# Altium schematic sheet charger.SchDoc
size A4; SheetNumber: 1; SheetTotal: 1
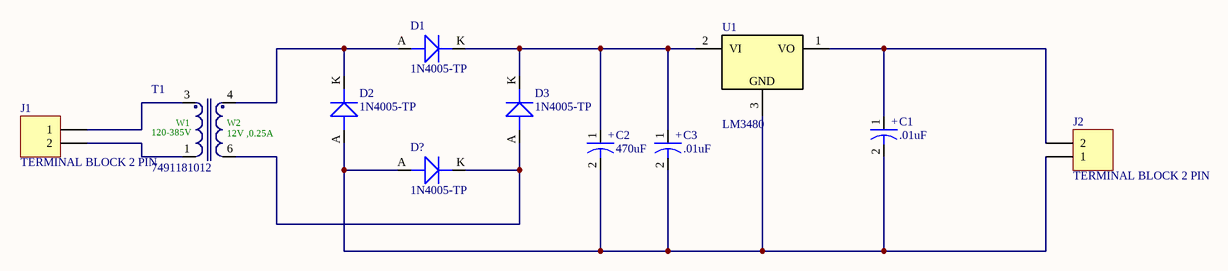
[diagram p0: charger.SchDoc]

## Parts
C1  .01uF  [ACAP_P305_D393_H393_RAD]
C2  470uF  [ACAP_P305_D393_H393_RAD]
C3  .01uF  [ACAP_P305_D393_H393_RAD]
D1  1N4005-TP  [DIO_DO-201AD_TH]
D2  1N4005-TP  [DIO_DO-201AD_TH]
D3  1N4005-TP  [DIO_DO-201AD_TH]
D?  1N4005-TP  [DIO_DO-201AD_TH]
J1  TERMINAL BLOCK 2 PIN  [CON2_P196_1729128_TH_ST]
J2  TERMINAL BLOCK 2 PIN  [CON2_P196_1729128_TH_ST]
T1  7491181012  [EE13_7_4-Vertical_(EF12.6)]
U1  LM3480  [SOT 23-3]

## Nets
NetC1_1: C1.1 J2.2 U1.1(VO)
NetC1_2: C1.2 C2.2 C3.2 D2.A(ANODE) D?.A(ANODE) J2.1 U1.3
NetC2_1: C2.1 C3.1 D1.K(CATHODE) D3.K(CATHODE) U1.2(VI)
NetD1_A: D1.A(ANODE) D2.K(CATHODE) T1.4
NetD3_A: D3.A(ANODE) D?.K(CATHODE) T1.6
NetJ1_1: J1.1 T1.3
NetJ1_2: J1.2 T1.1

## Notes on the sheet
- (in symbol CAP-P_100uF-50V-20%-RAD) +
- (in symbol CMP-1476-00004-1) W1; W2; 120-385V; 12V ,0.25A
- (in symbol REG_30V-5V-100mA-1.4W-SOT23-3) GND

## Library data of the parts
C1-C3 = CAP-P_100uF-50V-20%-RAD: 100µF 50V Aluminum Polymer Capacitor Radial, Can - SMD 28mOhm 4000 Hrs @ 125°C; Manufacturer: Nichicon; Manufacturer Part Number: GYA1H101MCQ1GS; Alternate Part Number-1: VEU101M1HTR-1010; Case/Package: Radial-SMD; Supplier-1: SP ROAD; Supplier Part Number-1: GYA1H101MCQ1GS
D1-D3 D? = DIO_600V-1A-DO-41: Diode Standard 600V 1A Through Hole DO-41; Manufacturer: Vishay Semiconductors; Alternate Part Number-1: NA; Manufacturer Part Number: 1N4005-TP; Case/Package: DO-41; Supplier-1: SIRICOM; Supplier Part Number-1: 1N4007
J1 J2 = CON-TB_2X1-196-ST-TH: 2 Pins, 1 Row 5mm Pitch, straight Connector, male; Manufacturer: Phoenix Contact; Manufacturer Part Number: MKDSN1,5/2; Alternate Part Number-1: NA; Case/Package: TH-CON; Supplier-1: SP ROAD; Supplier Part Number-1: MKDSN1,5/2
T1 = CMP-1476-00004-1: Off-Line Transformer WE-UNIT , L=2.8mH; Manufacturer: Wuerth Elektronik; Output Voltage (DC): 12; Turns Ratio: "8.1","1"; Output Current (A): 0.25; Inductance: 2.8mH; Input Voltage (AC): 85-265; ComponentLink2URL: http://www.we-online.de/katalog/media/pdf/7491181012.pdf; PartNumber: 7491181012; ComponentLink1Description: Manufacturer URL; ComponentLink1URL: http://www.we-online.com; ComponentLink2Description: Datasheet; PackageReference: EE13_7_4-Vertical_(EF12.6)
U1 = REG_30V-5V-100mA-1.4W-SOT23-3: Linear Voltage Regulator IC 1 Output 100mA SOT-23-3; Manufacturer: Texas Instruments; Manufacturer Part Number: LM3480IM3-5.0/NOPB; Alternate Part Number-1: NA; Case/Package: SOT23-3; Supplier-1: CATLOG COMPONENTS; Supplier Part Number-1: LM3480IM3-5.0/NOPB